# EAGLE design NodeMCU-Gateway-NRF (EAGLE 7.6.0)
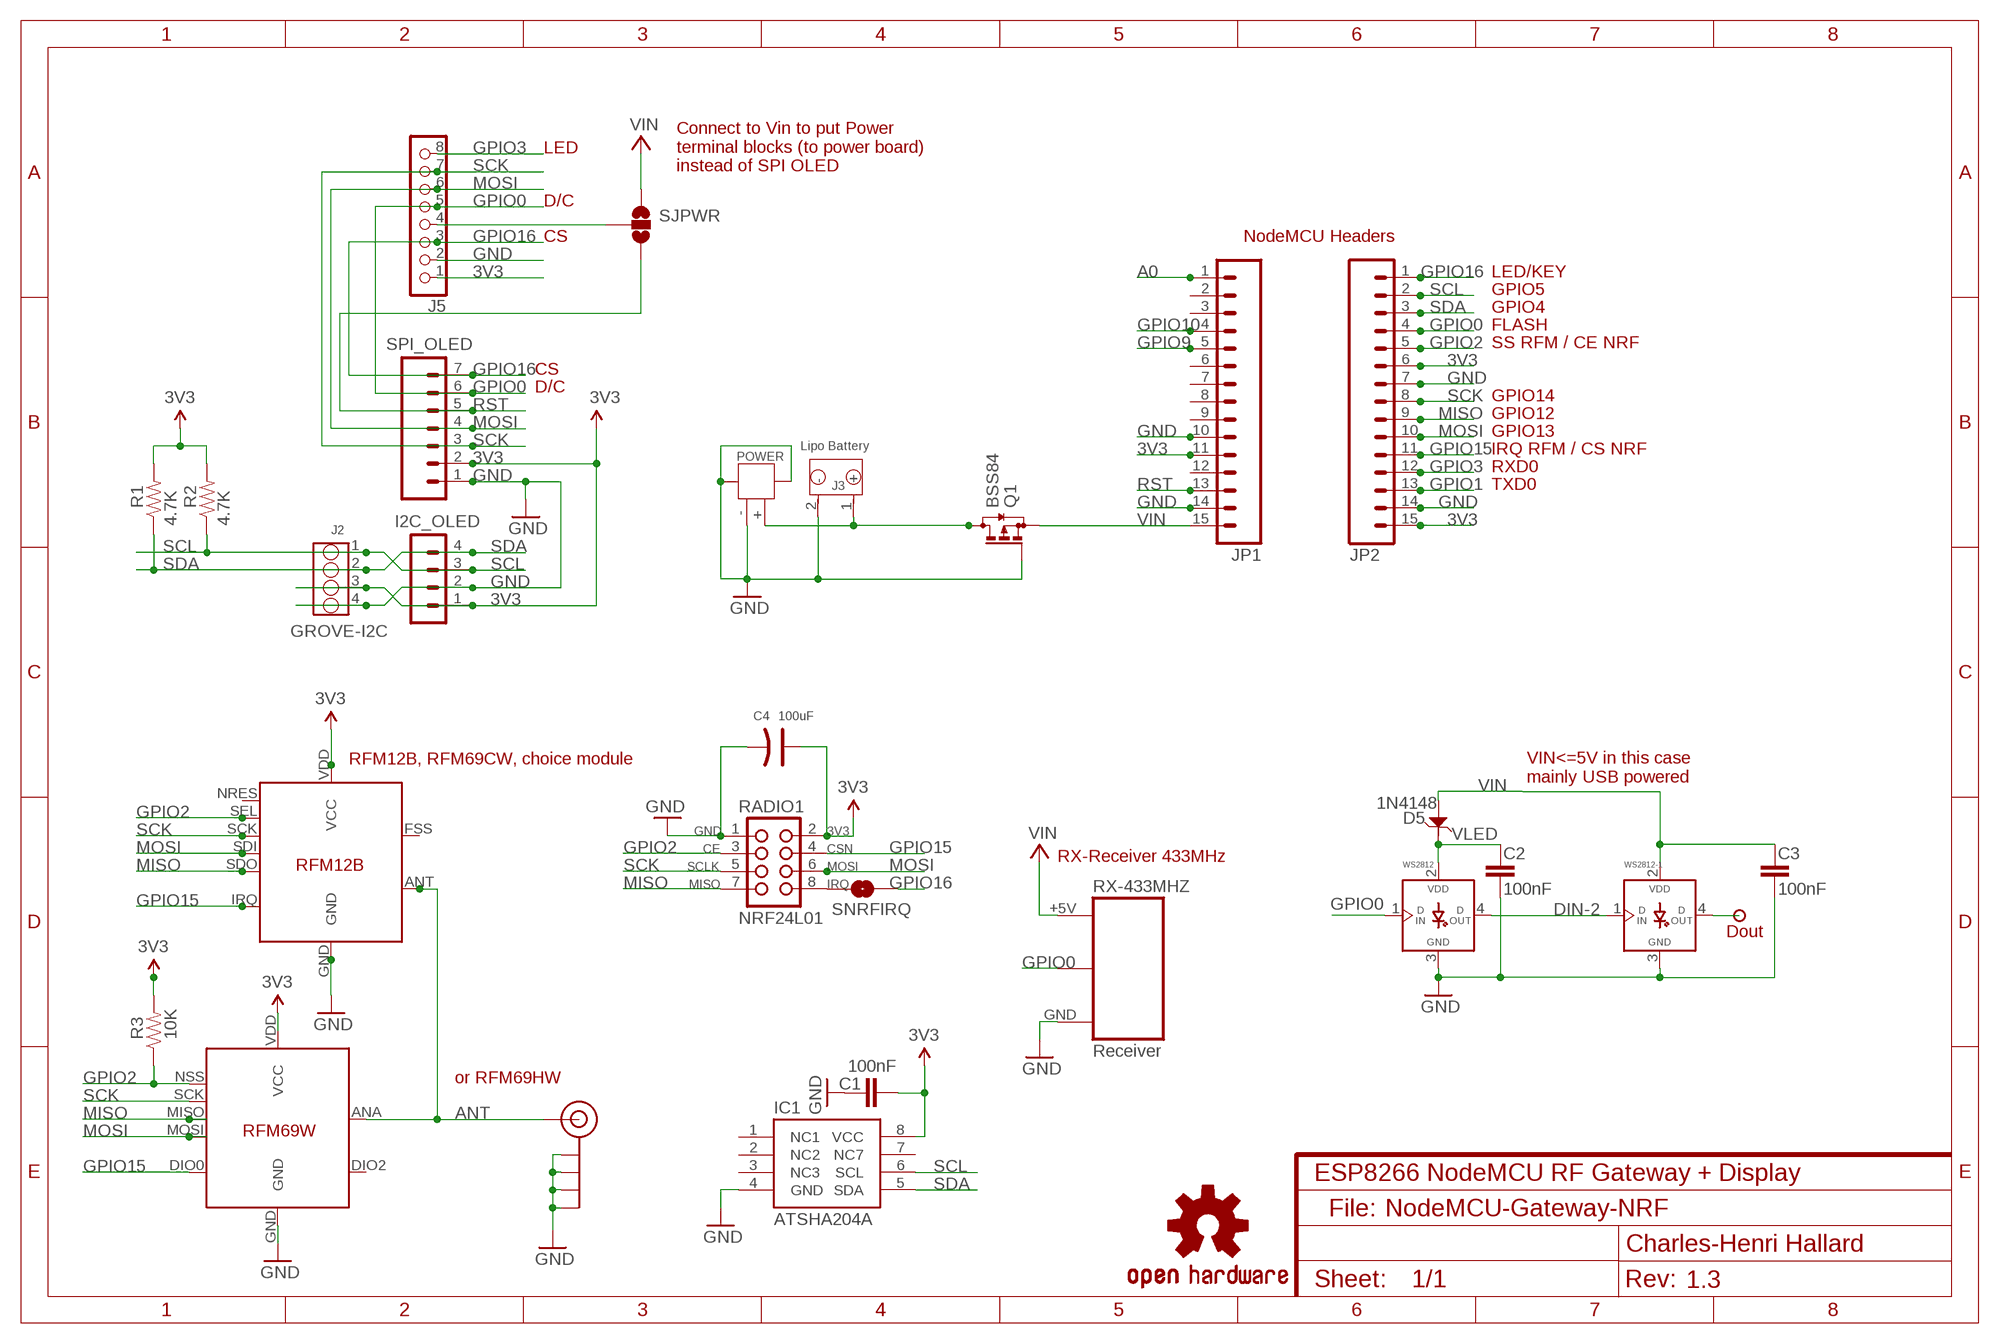
[diagram p0: schematic, sheet 1]
NAME (FRAME-A4L): CNAME: ESP8266 NodeMCU RF Gateway + Display; CREVISION: 1.3; DESIGNER: Charles-Henri Hallard

## Parts
C1  100nF  CAP0805-CAP  [0805-CAP]
C2  100nF  CAP0805-CAP  [0805-CAP]
C3  100nF  CAP0805-CAP  [0805-CAP]
C4  100uF  CAP-POLAR-D5.3/2.0  [RADIAL-2.0-D5.0*H7MM]
D5  1N4148  D-ESD-2P-CESD5V0D1  [SOD123-2.7X1.6]
I2C_OLED  CON_HEADER_1X04'LOCK'  [1X04_LOCK]
IC1  ATSHA204A  ATSHA204_SOIC8  [SOIC8]
J2  GROVE-I2C  GROVE-4P-2.0-3470140P1  [4P-2.0-90D]
J3  Lipo Battery  JST-2P-PW-3410070P1  [2P-2.0-90D]
J5  CON_HEADER_1X08-PTH  [M1X8]
J$2  ANTENNATINY  [SMA_UFL_PAD_TINY]
JP1  M15LOCK  [1X15_LOCK]
JP2  M15LOCK  [1X15_LOCK]
LOGO2  OSHW-LOGOL  [OSHW-LOGO-L]
P2  PADNORMAL  [PAD]
POWER  JST-2P-SMD'2.0'  [2P-SMD-2.0-90D]
Q1  BSS84  [SOT23]
R1  4.7K  RESISTOR0805-RES  [0805-RES]
R2  4.7K  RESISTOR0805-RES  [0805-RES]
R3  10K  RESISTOR0805-RES  [0805-RES]
RADIO1  NRF24L01  [2X04_NO_LOCK]
RX-433MHZ  Receiver  RF-LINK_RX  [RF-LINK_RX_NO_SILK]
SJPWR  JUMPER-PAD-3-2OF3_NC_BY_TRACE_LARGE  [PAD-JUMPER-3-2OF3_NC_BY_TRACE_YES_SILK_LARGE]
SNRFIRQ  NRFIRQ  JUMPER-PAD-2-NOYES_SILK  [PAD-JUMPER-2-NO_YES_SILK]
SPI_OLED  CON_HEADER_1X07'SMALL'  [M1X7]
U$2  RFM12B  [RFM12B-MINPADS]
U$3  RFM69W  [RFM69W-MINPADS]
WS2812  WS2812B  WS2812B5MM  [WS2812-PTH]
WS2812-1  WS2812B  WS2812B5MM  [WS2812-PTH]

## Nets
3V3: C1.2 C4.+ I2C_OLED.1 IC1.8(VCC) J2.3 J5.1 JP1.11 JP2.6 JP2.15 R1.2 R2.2 R3.2 RADIO1.2(3V3) SPI_OLED.2 U$2.VDD(VCC) U$3.VDD(VCC)
A0: JP1.1
ANT: J$2.ANT1(SIGNAL) J$2.ANT2(SIGNAL) J$2.ANT3(SIGNAL) U$2.ANT U$3.ANA(ANT)
DIN-2: WS2812-1.1(DIN) WS2812.4(DOUT)
GND: C1.1 C2.1 C3.1 C4.- I2C_OLED.2 IC1.4(GND) J2.4 J3.2(-) J5.2 J$2.GND1(GND) J$2.GND2(GND) J$2.GND3(GND) J$2.GND4(GND) JP1.10 JP1.14 JP2.7 JP2.14 POWER.3 POWER.4 POWER.- Q1.1(G) RADIO1.1(GND) RX-433MHZ.GND SPI_OLED.1 U$2.GND U$3.GND WS2812-1.3(GND) WS2812.3(GND)
GPIO0: J5.5 JP2.4 RX-433MHZ.DATA@1(DATA) RX-433MHZ.DATA@2(DATA) SPI_OLED.6 WS2812.1(DIN)
GPIO1: JP2.13
GPIO2: JP2.5 R3.1 RADIO1.3(CE) U$2.SEL U$3.NSS(SEL)
GPIO3: J5.8 JP2.12
GPIO9: JP1.5
GPIO10: JP1.4
GPIO15: JP2.11 RADIO1.4(CSN) U$2.IRQ U$3.DIO0
GPIO16: J5.3 JP2.1 SNRFIRQ.2 SPI_OLED.7
MISO: JP2.9 RADIO1.7(MISO) U$2.SDO U$3.MISO
MOSI: J5.6 JP2.10 RADIO1.6(MOSI) SPI_OLED.4 U$2.SDI U$3.MOSI
N$1: P2.1 WS2812-1.4(DOUT)
N$2: J5.4 SJPWR.2
N$4: RADIO1.8(IRQ) SNRFIRQ.1
PWR: J3.1(+) POWER.+ Q1.3(D)
RST: JP1.13 SJPWR.3 SPI_OLED.5
SCK: J5.7 JP2.8 RADIO1.5(CLK) SPI_OLED.3 U$2.SCK U$3.SCK
SCL: I2C_OLED.3 IC1.6(SCL) J2.1 JP2.2 R2.1
SDA: I2C_OLED.4 IC1.5(SDA) J2.2 JP2.3 R1.1
VIN: C3.2 D5.1 JP1.15 Q1.2(S) RX-433MHZ.+5V SJPWR.1 WS2812-1.2(VDD)
VLED: C2.2 D5.2 WS2812.2(VDD)
Unconnected: IC1.1(NC1) IC1.2(NC2) IC1.3(NC3) IC1.7(NC7) JP1.2 JP1.3 JP1.6 JP1.7 JP1.8 JP1.9 JP1.12 U$2.FSS(FFS) U$2.NRES U$3.DIO2

## Notes on the sheet
- LED
- Connect to Vin to put Power
  terminal blocks (to power board)
  instead of SPI OLED
- D/C
- CS | NodeMCU Headers
- LED/KEY
- GPIO5
- GPIO4
- FLASH
- SS RFM / CE NRF
- CS
- D/C
- GPIO14
- GPIO12
- GPIO13
- IRQ RFM / CS NRF
- RXD0
- TXD0
- RFM12B, RFM69CW, choice module
- VIN<=5V in this case
  mainly USB powered
- RX-Receiver 433MHz
- Dout
- or RFM69HW
- File:

## Library data of the parts
C1-C3 = _c2h:CAP: Capacitor Standard 0603 ceramic capacitor, and 0.1" leaded capacitor.
C4 = Seeed-OPL-Discrete:CAP-POLAR: Electrolytic Capacitors,Tantalum Capacitors and Super Capacitors
D5 = Seeed-Discrete:D-ESD-2P: Diodes for Protectiong against ESD
I2C_OLED = _c2h:CON_HEADER_1X04
IC1 = SparkFun-DigitalIC:ATSHA204_SOIC8: ATSHA204; PROD_ID: IC-11981
J2 = seeed-opl-Connector:GROVE-4P-2.0
J3 = Seeed-Connector:JST-2P-PW
J5 = dp_devices:CON_HEADER_1X08
J$2 = _c2h:ANTENNA: SMA Antenna Connector End launch SMA connector. The paste layer has been removed so that the connector can be hand soldered onto the board after reflow.
JP1 JP2 = SparkFun-Connectors:M15: Header 15 Standard 15-pin 0.1" header. Use with straight break away headers (SKU : PRT-00116), right angle break away headers (PRT-00553), swiss pins (PRT-00743), machine pins (PRT-00117), and female headers (PRT-00115).
LOGO2 = SparkFun-Aesthetics:OSHW-LOGO: Open Source Hardware Logo This logo indicates the piece of hardware it is found on incorporates a OSHW license and/or adheres to the definition of open source hardware found here: http://freedomdefined.org/OSHW
P2 = _c2h:PAD
POWER = Seeed-Connector:JST-2P-SMD: 2P-SMD-2.0-90D:320110026
Q1 = transistor-small-signal:BSS84: P-CHANNEL MOS FET
R1-R3 = _c2h:RESISTOR: Resistor Basic schematic elements and footprints for 0603, 1206, and PTH resistors.
RADIO1 = _c2h:NRF24L01
RX-433MHZ = _c2h:RF-LINK_RX: RF Link receivers- WRL-8947, 8948, 8949, 8950, 10532, 10533
SJPWR = SparkFun-Passives:JUMPER-PAD-3-2OF3_NC_BY_TRACE
SNRFIRQ = SparkFun-Passives:JUMPER-PAD-2-NO
SPI_OLED = _c2h:CON_HEADER_1X07
U$2 = _c2h:RFM12B
U$3 = _c2h:RFM69W
WS2812 WS2812-1 = _c2h:WS2812B

## Net classes
0 default: width 0.203 mm, drill 0.356 mm, clearance 0.152 mm
1 power: width 0.203 mm, clearance 0.152 mm

## Board
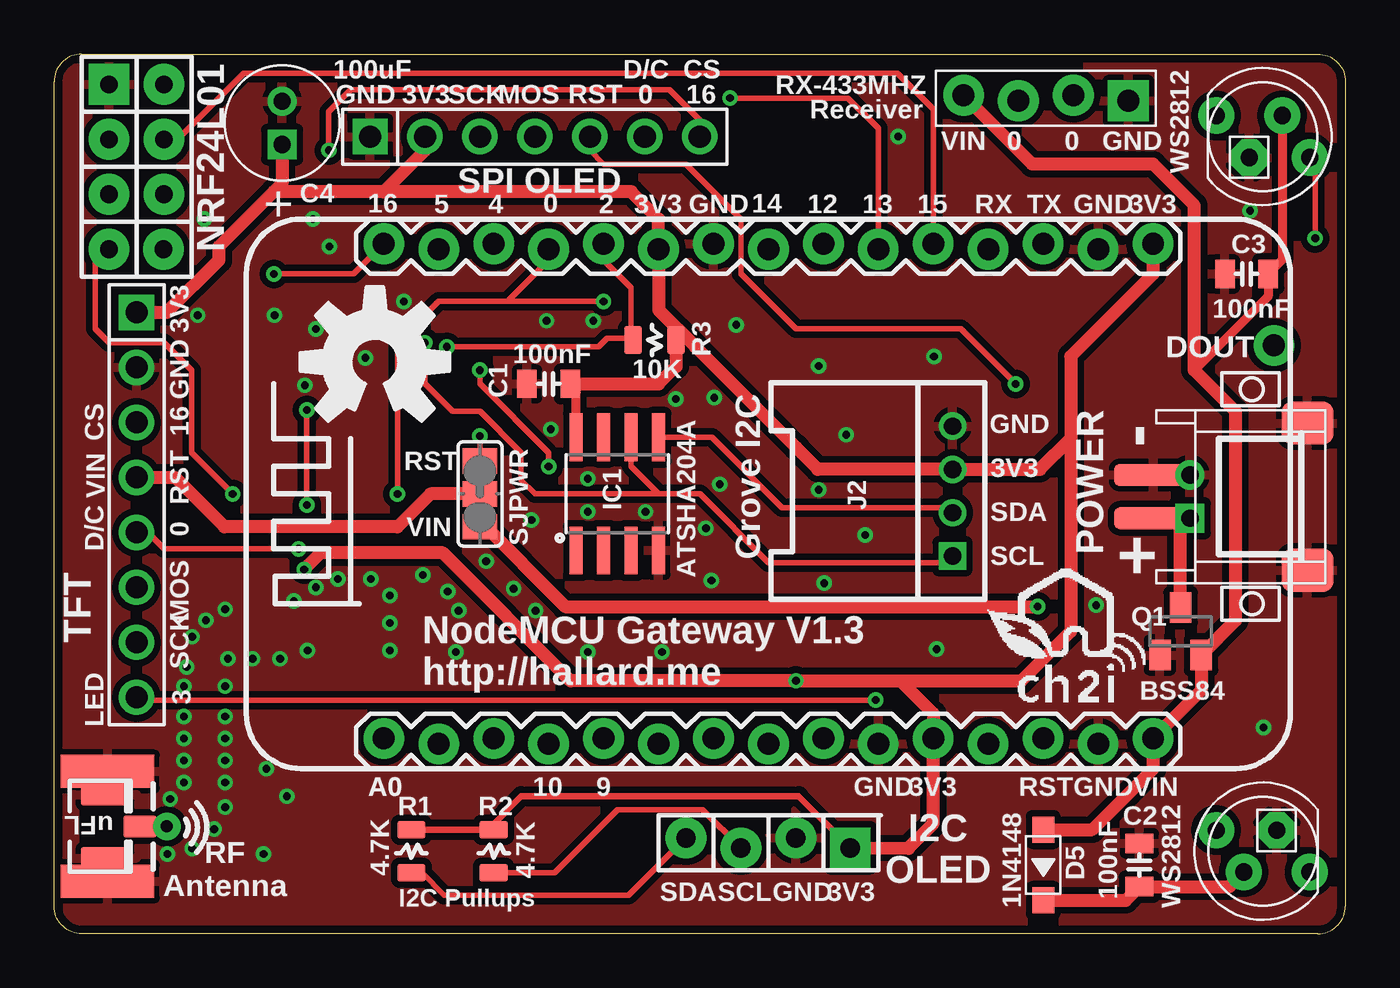
[diagram p1: board, top side]
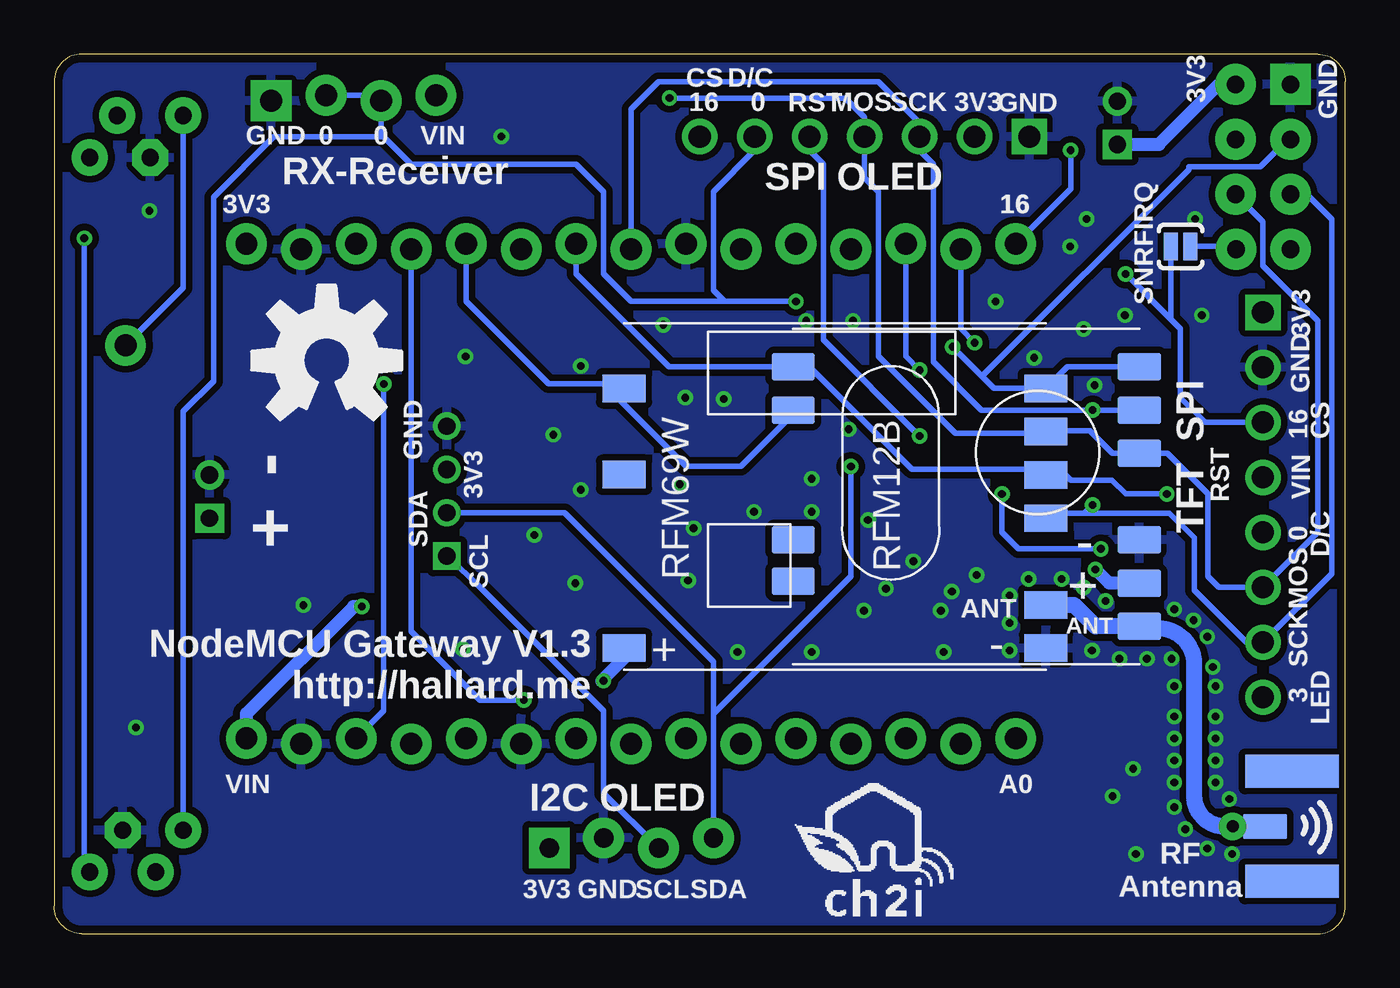
[diagram p2: board, bottom side, seen from below]

Size 59.69 x 40.64 mm. Coordinates in mm from the lower left corner, seen from the top.
Outline: 1.27,40.64 58.42,40.64 arc-90 59.69,39.37 59.69,1.27 arc-90 58.42,0 1.27,0 arc-90 0,1.27 0,39.37 arc-90 1.27,40.64
Copper layers (1*16): Top 0.0356mm / dielectric 1.5011mm / Bottom 0.0356mm
Design rules "PCBs_io": minimum track width 6mil, minimum drill 13mil, track to track 6mil, track to pad 6mil, pad to pad 6mil, via to via 6mil, smd to smd 6mil, copper to edge 15mil, drill to drill 6mil, minimum pad ring 7mil, minimum via ring 7mil, stop-mask expansion 3mil, vias tented up to drill 40mil, thermal gap 10mil

### Footprints (pad centres in the part's own frame; a part is rotated, then mirrored left to right if it is on the bottom)
0805-CAP = smd 0.902 x 1.3: 1 -1,0; 2 1,0
RADIAL-2.0-D5.0*H7MM = drill 0.8 pad 1.35 square: + -1,0 | drill 0.8 pad 1.35: - 1,0
SOD123-2.7X1.6 = smd 1.2 x 1.02: 1 -1.635,0; 2 1.635,0
1X04_LOCK = drill 0.9 pad 1.88 square: 1 1.295,1.372 | drill 0.9 pad 1.88: 2 3.81,0.914; 3 6.35,1.372; 4 8.89,0.914
SOIC8 = smd 0.61 x 2.21: 1 -1.905,-2.616; 2 -0.635,-2.616; 3 0.635,-2.616; 4 1.905,-2.616; 5 1.905,2.616; 6 0.635,2.616; 7 -0.635,2.616; 8 -1.905,2.616
4P-2.0-90D = drill 0.8 pad 1.27 square: 1 -3,0 | drill 0.8 pad 1.27: 2 -1,0; 3 1,0; 4 3,0
2P-2.0-90D = drill 0.8 pad 1.35 square: 1 -1,3.25 | drill 0.8 pad 1.35: 2 1,3.25
M1X8 = drill 1.02 pad 1.632 square: 1 -8.89,0 | drill 1.02 pad 1.632: 2 -6.35,0; 3 -3.81,0; 4 -1.27,0; 5 1.27,0; 6 3.81,0; 7 6.35,0; 8 8.89,0
SMA_UFL_PAD_TINY = smd 1.524 x 1.016: ANT1 -3.843,0 | drill 0.559 pad 1.27: ANT2 -5.08,0 | smd 2.032 x 1.143 bottom: ANT3 -3.589,0 | smd 2.2 x 1.016: GND1 -2.223,1.47; GND2 -2.223,-1.47 | smd 4.318 x 1.524: GND3 -2.349,-2.54; GND4 -2.349,2.54 | smd 4.318 x 1.524 bottom: GND5 -2.349,2.54; GND6 -2.349,-2.54
1X15_LOCK = drill 1.016 pad 1.88: 1 0,0.127; 2 2.54,-0.127; 3 5.08,0.127; 4 7.62,-0.127; 5 10.16,0.127; 6 12.7,-0.127; 7 15.24,0.127; 8 17.78,-0.127; 9 20.32,0.127; 10 22.86,-0.127; 11 25.4,0.127; 12 27.94,-0.127; 13 30.48,0.127; 14 33.02,-0.127; 15 35.56,0.127
PAD = drill 1.016 pad 1.88: 1 0,0
2P-SMD-2.0-90D = smd 2 x 2.4: 3 3.4,-2.181; 4 -3.4,-2.181 | smd 1 x 3.6: + -1,4.953; - 1,4.953
SOT23 = smd 1 x 1.4: 1 -0.95,-1.1; 2 0.95,-1.1; 3 0,1.1
0805-RES = smd 0.8 x 1.3: 1 -1,0; 2 1,0
2X04_NO_LOCK = drill 0.813 pad 1.88 square: 1 -3.81,-1.27 | drill 0.813 pad 1.88: 2 -3.81,1.27; 3 -1.27,-1.27; 4 -1.27,1.27; 5 1.27,-1.27; 6 1.27,1.27; 7 3.81,-1.27; 8 3.81,1.238
RF-LINK_RX_NO_SILK = drill 1.016 pad 1.88: +5V 7.62,1.143; DATA@1 2.54,1.143; DATA@2 5.08,1.397 | drill 1.016 pad 1.88 square: GND 0,1.397
PAD-JUMPER-3-2OF3_NC_BY_TRACE_YES_SILK_LARGE = smd 1.168 x 1.6: 1 -1.524,0; 2 0,0; 3 1.524,0
PAD-JUMPER-2-NO_YES_SILK = smd 0.635 x 1.27: 1 -0.45,0; 2 0.45,0
M1X7 = drill 1.02 pad 1.632 square: 1 -6.35,0 | drill 1.02 pad 1.632: 2 -3.81,0; 3 -1.27,0; 4 1.27,0; 5 3.81,0; 6 6.35,0; 7 8.89,0
RFM12B-MINPADS = smd 2 x 1.27: ANT 8,-6; FSS -8.002,-2; GND 8,-2; IRQ -8,4; NRES -8.002,-3.905; SCK 8,4; SDI 8,2; SDO -8,6; SEL 8,6; VDD 8,-4
RFM69W-MINPADS = smd 2 x 1.27: ANA 8,-5; DIO0 -11.5,5; DIO2 -11.5,1.012; GND 8,-7; MISO 8,1; MOSI 8,3; NSS 8,5; SCK 8,-1; VDD -11.5,-7
WS2812-PTH = drill 0.8 pad 1.676: 1 2.159,-0.968; 2 0.889,0.968; 4 -2.159,0.968 | drill 0.8 pad 1.676 octagon: 3 -0.635,-0.968

### Placement (x,y rotation side)
C1  22.86,25.4 0 top
C2  50.16,3.17 270 top
C3  55.12,30.48 0 top
C4  10.54,37.47 90 top
D5  45.72,3.17 270 top
I2C_OLED  38.1,5.33 180 top
IC1  26.04,20.32 0 top
J2  41.53,20.45 90 top
J3  55.75,20.19 90 top
J5  3.81,19.81 270 top
J$2  0.13,4.95 180 top
JP1  15.24,8.89 0 top
JP2  15.24,31.75 0 top
LOGO1  OSHW-LOGOL  [OSHW-LOGO-L]  14.83,26.42 0 top
LOGO2  47.09,26.48 0 bottom
P2  56.39,27.18 0 top
POWER  55.75,20.19 90 top
Q1  52.07,13.97 0 top
R1  16.51,3.81 90 top
R2  20.32,3.81 90 top
R3  27.75,27.43 0 top
RADIO1  3.81,35.43 270 top
RX-433MHZ  49.66,39.88 180 top
SJPWR  19.68,20.32 90 top
SNRFIRQ  7.62,31.75 180 bottom
SPI_OLED  20.95,36.83 0 top
U$2  17.53,20.19 0 bottom
U$3  21.84,20.19 0 bottom
U$6  [LOGO_CH2I_75MM]  47.24,12.7 0 top
U$7  [LOGO_CH2I_75MM]  21.34,2.79 0 bottom
WS2812  55.88,3.81 180 top
WS2812-1  55.88,36.83 0 top

### Tracks (layer width: path | path; a pad name or v marks a point on that pad's centre or on a via)
3V3  (via drill 0.36 pad 0.61, 0.36 pad 0.71)
  Top 0.254: R3.2 29.32,27.43 29.65,27.11
  Top 0.305: R2.2 R1.2 20.05,4.81 21.59,6.35 34.42,6.35 I2C_OLED.1
  Top 0.406: IC1.8 24.13,25.04 C1.2
  Top 0.61: I2C_OLED.1 39.5,3.94 40.64,5.08 JP1.11 40.64,10.16 39.12,11.68 | 15.24,34.29 17.14,36.2 SPI_OLED.2 | 15.24,34.29 26.67,34.29 27.94,33.02 JP2.6 27.94,28.81 29.65,27.11 34.29,22.46 | 15.24,34.29 15.22,34.27 | 39.12,11.68 v34.29,11.68 23.88,11.68 17.97,17.59 12.32,17.59 v11.56,16.83 | 34.29,22.46 34.31,22.46 | 34.29,22.46 35.31,21.45 J2.3 45.58,21.45 46.99,22.86 | JP2.15 50.8,30.48 46.99,26.67 46.99,22.86 | 46.99,22.86 46.99,13.97 44.7,11.68 39.12,11.68 | C1.2 27.94,25.4 28.75,26.21 R3.2 | 15.24,34.29 10.16,34.29 | 10.16,34.29 7.62,31.75 7.62,31.11 5.21,28.7 J5.1 | C4.+ 10.54,34.67 10.16,34.29
  Bottom 0.61: U$3.VDD 32.85,13.21 34.38,11.68 v34.29,11.68 | RADIO1.2 5.84,39.24 8.62,36.47 C4.+ | U$2.VDD 10.92,16.19 v11.56,16.83
ANT
  Top 0.61: J$2.ANT2 J$2.ANT1
  Bottom 0.61: J$2.ANT3 J$2.ANT2 5.59,4.95
  Bottom 0.75: U$2.ANT 10.16,14.19 | 10.16,14.19 11.56,14.19 12.56,15.19 U$3.ANA | 5.59,4.95 arc90 6.99,6.35 6.99,12.45 arc-90 8.64,14.1 10.06,14.1 arc90 10.16,14.19
DIN-2  (via drill 0.36 pad 0.71)
  Top 0.254: v58.29,32.13 58.29,35.61 WS2812-1.1
  Bottom 0.254: v58.29,32.13 58.29,3.1 WS2812.4
GND  (via drill 0.36 pad 0.71)
  Top 0.254: J$2.GND2 2.35,7.37 J$2.GND3 | J$2.GND1 2.35,2.54 J$2.GND4
  other vias: 40.67,26.67 9.68,3.68 9.81,7.62 22.07,19.11 18.7,14.92 16.16,29.21 10.76,6.35 48.16,15.18 39.02,36.83 55.91,9.53 35.59,16.19 10.19,28.57 30.51,24.77 37.5,18.41 40.8,13.14 22.96,23.3 6.95,33.02 11.97,33.02 5.24,3.68 5.37,6.22 6,6.99 6,8 6,9.02 6,10.03 6,11.43 6.13,12.32 7.91,14.99 7.02,14.48 6.38,13.72 7.91,9.02 7.91,10.03 7.91,11.43 7.91,8 7.91,6.99 8.03,12.7 9.18,12.7 10.45,12.7 11.72,13.08 15.53,15.62 15.53,14.35 15.53,13.08 11.08,15.37 14.64,16.38 13.11,16.38 12.1,16 6.38,3.94 7.91,5.84 7.4,4.83 17.05,16.57 19.97,17.21 21.24,15.94 24.67,13.02 28.1,13.02 30.38,16.32 24.67,21.02 24.67,19.49 27.34,19.49 28.73,24.7 30.13,18.73 30.77,20.76 14.38,26.61 11.59,25.34 18.57,13.02 22.26,14.92 18.19,15.81 55.28,33.4 35.34,20.51 36.61,23.05 35.34,26.23 31.53,28.13 6.64,28.57 12.1,27.94 12.73,31.75 24.92,28.32 22.76,28.32
  pour Bottom (isolate 0.305): 60.96,41.91 60.96,-1.27 -1.14,-1.4 -1.14,41.78
  pour Top (isolate 0.305): -2.41,43.05 62.23,43.18 62.23,-2.54 -2.41,-2.67
GPIO0  (via drill 0.36 pad 0.71)
  Top 0.254: J5.5 4.32,18.54 5.08,17.78 v11.3,17.78 | 20.95,29.21 17.78,29.21 15.88,27.3 v15.88,20.32 | 20.95,29.21 v25.4,29.21 | JP2.4 22.86,31.11 20.95,29.21
  Bottom 0.254: SPI_OLED.6 27.3,36.2 29.21,34.29 29.21,29.72 28.7,29.21 | 28.7,29.21 v25.4,29.21 | 44.45,36.83 44.58,36.96 RX-433MHZ.DATA@2 44.83,38.73 RX-433MHZ.DATA@1 | 44.45,36.83 43.18,35.56 35.56,35.56 34.29,34.29 34.29,30.48 33.02,29.21 28.7,29.21 | WS2812.1 53.72,24.13 52.32,25.53 52.32,34.04 49.53,36.83 44.45,36.83 | v11.3,17.78 15.11,17.78 15.88,18.54 v15.88,20.32
GPIO2  (via drill 0.36 pad 0.71)
  Top 0.254: v18.16,27.11 25.16,27.11 25.56,27.51 26.67,27.51 | JP2.5 25.4,31.11 26.67,29.84 26.67,27.51 | 26.67,27.51 R3.1
  Bottom 0.254: U$2.SEL 12.84,26.19 U$3.NSS 16.24,25.19 16.8,25.75 | 16.8,25.75 v18.16,27.11 | RADIO1.3 2.67,36.7 3.94,35.43 7.24,35.43 7.24,35.31 16.8,25.75
GPIO3  (via drill 0.36 pad 0.71)
  Top 0.254: v37.97,10.79 3.94,10.79 J5.8
  Bottom 0.254: v37.97,10.79 40.01,10.79 43.18,13.97 JP2.12
GPIO15
  Top 0.254: JP2.11 40.64,38.1 38.99,39.75 8.76,39.75 5.71,36.7 RADIO1.4
  Bottom 0.254: JP2.11 40.64,29.21 36.83,25.4 34.29,25.4 | U$2.IRQ 25.53,24 27.94,21.59 30.48,21.59 34.29,25.4 | 34.29,25.4 33.55,25.4 U$3.DIO0
GPIO16  (via drill 0.36 pad 0.71)
  Top 0.254: SPI_OLED.7 29.84,37.59 28.45,38.99 13.72,38.99 12.7,37.97 v12.7,36.2 | v10.16,30.48 13.84,30.48 JP2.1
  Bottom 0.254: J5.3 6.48,23.62 7.62,24.77 7.62,27.94 8.07,28.39 | v12.7,36.2 12.7,34.42 JP2.1 | 8.07,28.39 v10.16,30.48 | SNRFIRQ.2 8.07,28.39
MISO  (via drill 0.36 pad 0.71)
  Top 0.254: v8.26,20.32 6.35,22.23 6.35,26.04 5.08,27.3 2.54,27.3 1.91,27.94 1.91,31.11 RADIO1.7
  Bottom 0.254: 14.11,21.46 20.03,21.46 25.14,26.57 | JP2.9 35.56,30.48 31.27,26.19 U$2.SDO | U$3.MISO 12.94,21.19 12.7,20.95 10.79,20.95 10.16,20.32 v8.26,20.32
  Bottom 0.406: 14.11,21.46 U$3.MISO | 25.14,26.57 U$2.SDO
MOSI  (via drill 0.36 pad 0.71)
  Top 0.254: v31.24,38.61 36.7,38.61 38.1,37.21 JP2.10
  Bottom 0.254: U$2.SDI 9.49,22.19 | 13.92,23.11 18.03,23.11 21.59,26.67 21.59,34.29 22.23,34.92 SPI_OLED.4 22.23,37.72 23.11,38.61 v31.24,38.61 | 13.8,23.24 11.81,23.24 10.76,22.19 U$2.SDI | U$2.SDI 8.22,22.19 6.35,20.32 6.35,16.51 5.84,16 J5.6 1.27,18.54 1.27,28.32 3.81,30.86 3.81,32.89 RADIO1.6
  Bottom 0.406: 13.8,23.24 U$3.MOSI 13.92,23.11
N$1
  Bottom 0.254: WS2812-1.4 53.72,29.84 P2.1
N$2
  Top 0.61: SJPWR.2 17.4,20.32 15.88,18.8 7.87,18.8 5.59,21.08 J5.4
N$4
  Bottom 0.254: SNRFIRQ.1 5.17,31.75 RADIO1.8
PWR
  Top 0.61: Q1.3 52.07,18.76 J3.1 POWER.+
RST  (via drill 0.36 pad 0.71)
  Top 0.254: SPI_OLED.5 24.77,36.2 25.4,35.56 29.21,35.56 31.75,33.02 31.75,30.48 34.29,27.94 41.91,27.94 v44.45,25.4 | SJPWR.3 v19.68,22.99
  Bottom 0.254: SPI_OLED.5 24.77,36.2 24.13,35.56 24.13,27.43 v19.68,22.99 | v44.45,25.4 44.45,10.29 JP1.13
SCK  (via drill 0.36 pad 0.71)
  Top 0.254: v11.68,19.81 v11.68,24.19
  Bottom 0.254: 8.79,24.19 v11.68,24.19 16.83,24.19 19.05,26.42 19.05,35.56 19.68,36.2 SPI_OLED.3 19.68,37.47 21.59,39.37 31.75,39.37 33.02,38.1 JP2.8 | 12.06,19.43 8.13,19.43 6.99,18.29 6.99,15.88 4.57,13.46 J5.7 0.64,16.64 0.64,33.02 1.78,34.16 RADIO1.5 | U$3.SCK 13.84,19.43 12.06,19.43 | 12.06,19.43 v11.68,19.81
  Bottom 0.406: U$2.SCK 8.79,24.19
SCL  (via drill 0.36 pad 0.71)
  Top 0.254: R2.1 23.13,2.81 26.04,5.71 29.97,5.71 I2C_OLED.3 | IC1.6 26.67,21.59 27.94,20.32 | 27.94,20.32 29.84,20.32 33.02,17.14 41.23,17.14 J2.1 | v17.14,27.3 17.14,25.4 18.41,24.13 19.68,24.13 21.59,22.23 21.59,20.95 22.23,20.32 27.94,20.32
  Bottom 0.254: I2C_OLED.3 34.29,6.48 34.29,10.29 40.26,16.26 J2.1 | JP2.2 17.78,27.94 v17.14,27.3
SDA  (via drill 0.36 pad 0.71)
  Top 0.254: I2C_OLED.4 26.54,1.78 18.03,1.78 17,2.81 R1.1 | IC1.5 30.4,22.94 33.66,19.68 41.29,19.68 J2.2 | v19.68,26.04 19.68,25.4 22.86,22.23 v22.86,21.59
  Bottom 0.254: I2C_OLED.4 29.21,10.16 | 29.21,10.16 29.21,12.57 36.08,19.45 J2.2 | JP2.3 20.32,26.67 v19.68,26.04 | v22.86,21.59 22.86,16.51 29.21,10.16
VIN  (via drill 0.36 pad 0.71)
  Top 0.406: WS2812-1.2 56.77,31.13 C3.2 56.12,29.45 52.7,26.04
  Top 0.61: RX-433MHZ.+5V 45.21,35.56 50.8,35.56 52.7,33.66 52.7,26.04 54.61,24.13 54.61,14.46 Q1.2 53.02,11.24 JP1.15 50.8,7.62 47.99,4.81 D5.1 | v45.47,15.11 23.62,15.11 19.68,19.05 SJPWR.1
  Bottom 0.61: v45.47,15.11 45.85,15.11 50.8,10.16 JP1.15
VLED
  Top 0.61: WS2812.2 54.32,2.17 C2.2 49.53,1.54 D5.2

### Text on the board
tNames: D/C | CS | WS2812 | GND | 3V3 | SCK | MOS | 0 | 16 | RST | VIN | 0 | 0 | GND | SPI OLED | 16 | 5 | 4 | 0 | 2 | 3V3 | GND | 14 | 12 | 13 | 15 | RX | TX | GND | 3V3 | 3V3 | GND | DOUT | CS | Grove I2C | 16 | GND | - | VIN | RST | RST | 3V3 | D/C | 0 | SDA | VIN | + | TFT | MOS | SCL | SCK | LED | 3 | NodeMCU Gateway V1.3 / http://hallard.me | A0 | A0 | 10 | 9 | GND | 3V3 | RST | GND | VIN | I2C / OLED | RF / Antenna | I2C Pullups | SDA | SCL | GND | 3V3
bNames: 3V3 | GND | GND | 3V3 | SCK | MOS | 0 | D/C | 16 | CS | RST | RX-Receiver | VIN | 0 | 0 | GND | SPI OLED | 16 | 16 | 3V3 | 3V3 | TFT SPI | GND | GND | CS | 16 | - | RST | VIN | 3V3 | SDA | + | 0 | SCL | D/C | MOS | NodeMCU Gateway V1.3 / http://hallard.me | SCK | 3 | LED | A0 | I2C OLED | VIN | RF / Antenna | SDA | SCL | GND | 3V3